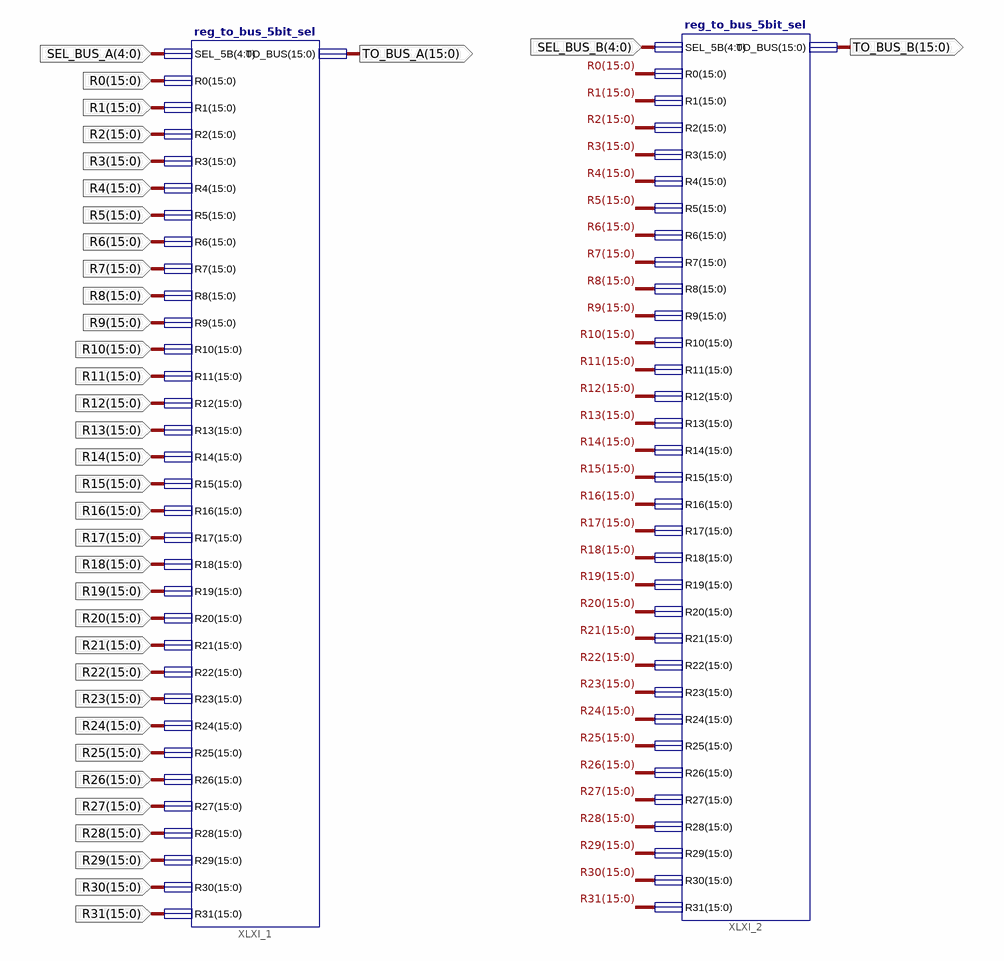
[diagram p0: schematic sheet 1]
// Xilinx ISE schematic bloque_3.sch (artix7) as structural Verilog: 2 symbols, 36 ports
module bloque_3 (
  input  [4:0] SEL_BUS_A,
  input  [4:0] SEL_BUS_B,
  input  [15:0] R0,
  input  [15:0] R1,
  input  [15:0] R2,
  input  [15:0] R3,
  input  [15:0] R4,
  input  [15:0] R5,
  input  [15:0] R6,
  input  [15:0] R7,
  input  [15:0] R8,
  input  [15:0] R9,
  input  [15:0] R10,
  input  [15:0] R11,
  input  [15:0] R12,
  input  [15:0] R13,
  input  [15:0] R14,
  input  [15:0] R15,
  input  [15:0] R16,
  input  [15:0] R17,
  input  [15:0] R18,
  input  [15:0] R19,
  input  [15:0] R20,
  input  [15:0] R21,
  input  [15:0] R22,
  input  [15:0] R23,
  input  [15:0] R24,
  input  [15:0] R25,
  input  [15:0] R26,
  input  [15:0] R27,
  input  [15:0] R28,
  input  [15:0] R29,
  input  [15:0] R30,
  input  [15:0] R31,
  output [15:0] TO_BUS_A,
  output [15:0] TO_BUS_B
);

  reg_to_bus_5bit_sel XLXI_1 (
    .SEL_5B(SEL_BUS_A), .R0(R0), .R1(R1), .R2(R2), .R3(R3), .R4(R4), .R5(R5), .R6(R6), .R7(R7), .R8(R8),
    .R9(R9), .R10(R10), .R11(R11), .R12(R12), .R13(R13), .R14(R14), .R15(R15), .R16(R16), .R17(R17),
    .R18(R18), .R19(R19), .R20(R20), .R21(R21), .R22(R22), .R23(R23), .R24(R24), .R25(R25), .R26(R26),
    .R27(R27), .R28(R28), .R29(R29), .R30(R30), .R31(R31), .TO_BUS(TO_BUS_A));
  reg_to_bus_5bit_sel XLXI_2 (
    .SEL_5B(SEL_BUS_B), .R0(R0), .R1(R1), .R2(R2), .R3(R3), .R4(R4), .R5(R5), .R6(R6), .R7(R7), .R8(R8),
    .R9(R9), .R10(R10), .R11(R11), .R12(R12), .R13(R13), .R14(R14), .R15(R15), .R16(R16), .R17(R17),
    .R18(R18), .R19(R19), .R20(R20), .R21(R21), .R22(R22), .R23(R23), .R24(R24), .R25(R25), .R26(R26),
    .R27(R27), .R28(R28), .R29(R29), .R30(R30), .R31(R31), .TO_BUS(TO_BUS_B));
endmodule
